# Altium schematic sheet _accel_mag.SchDoc
size Tabloid
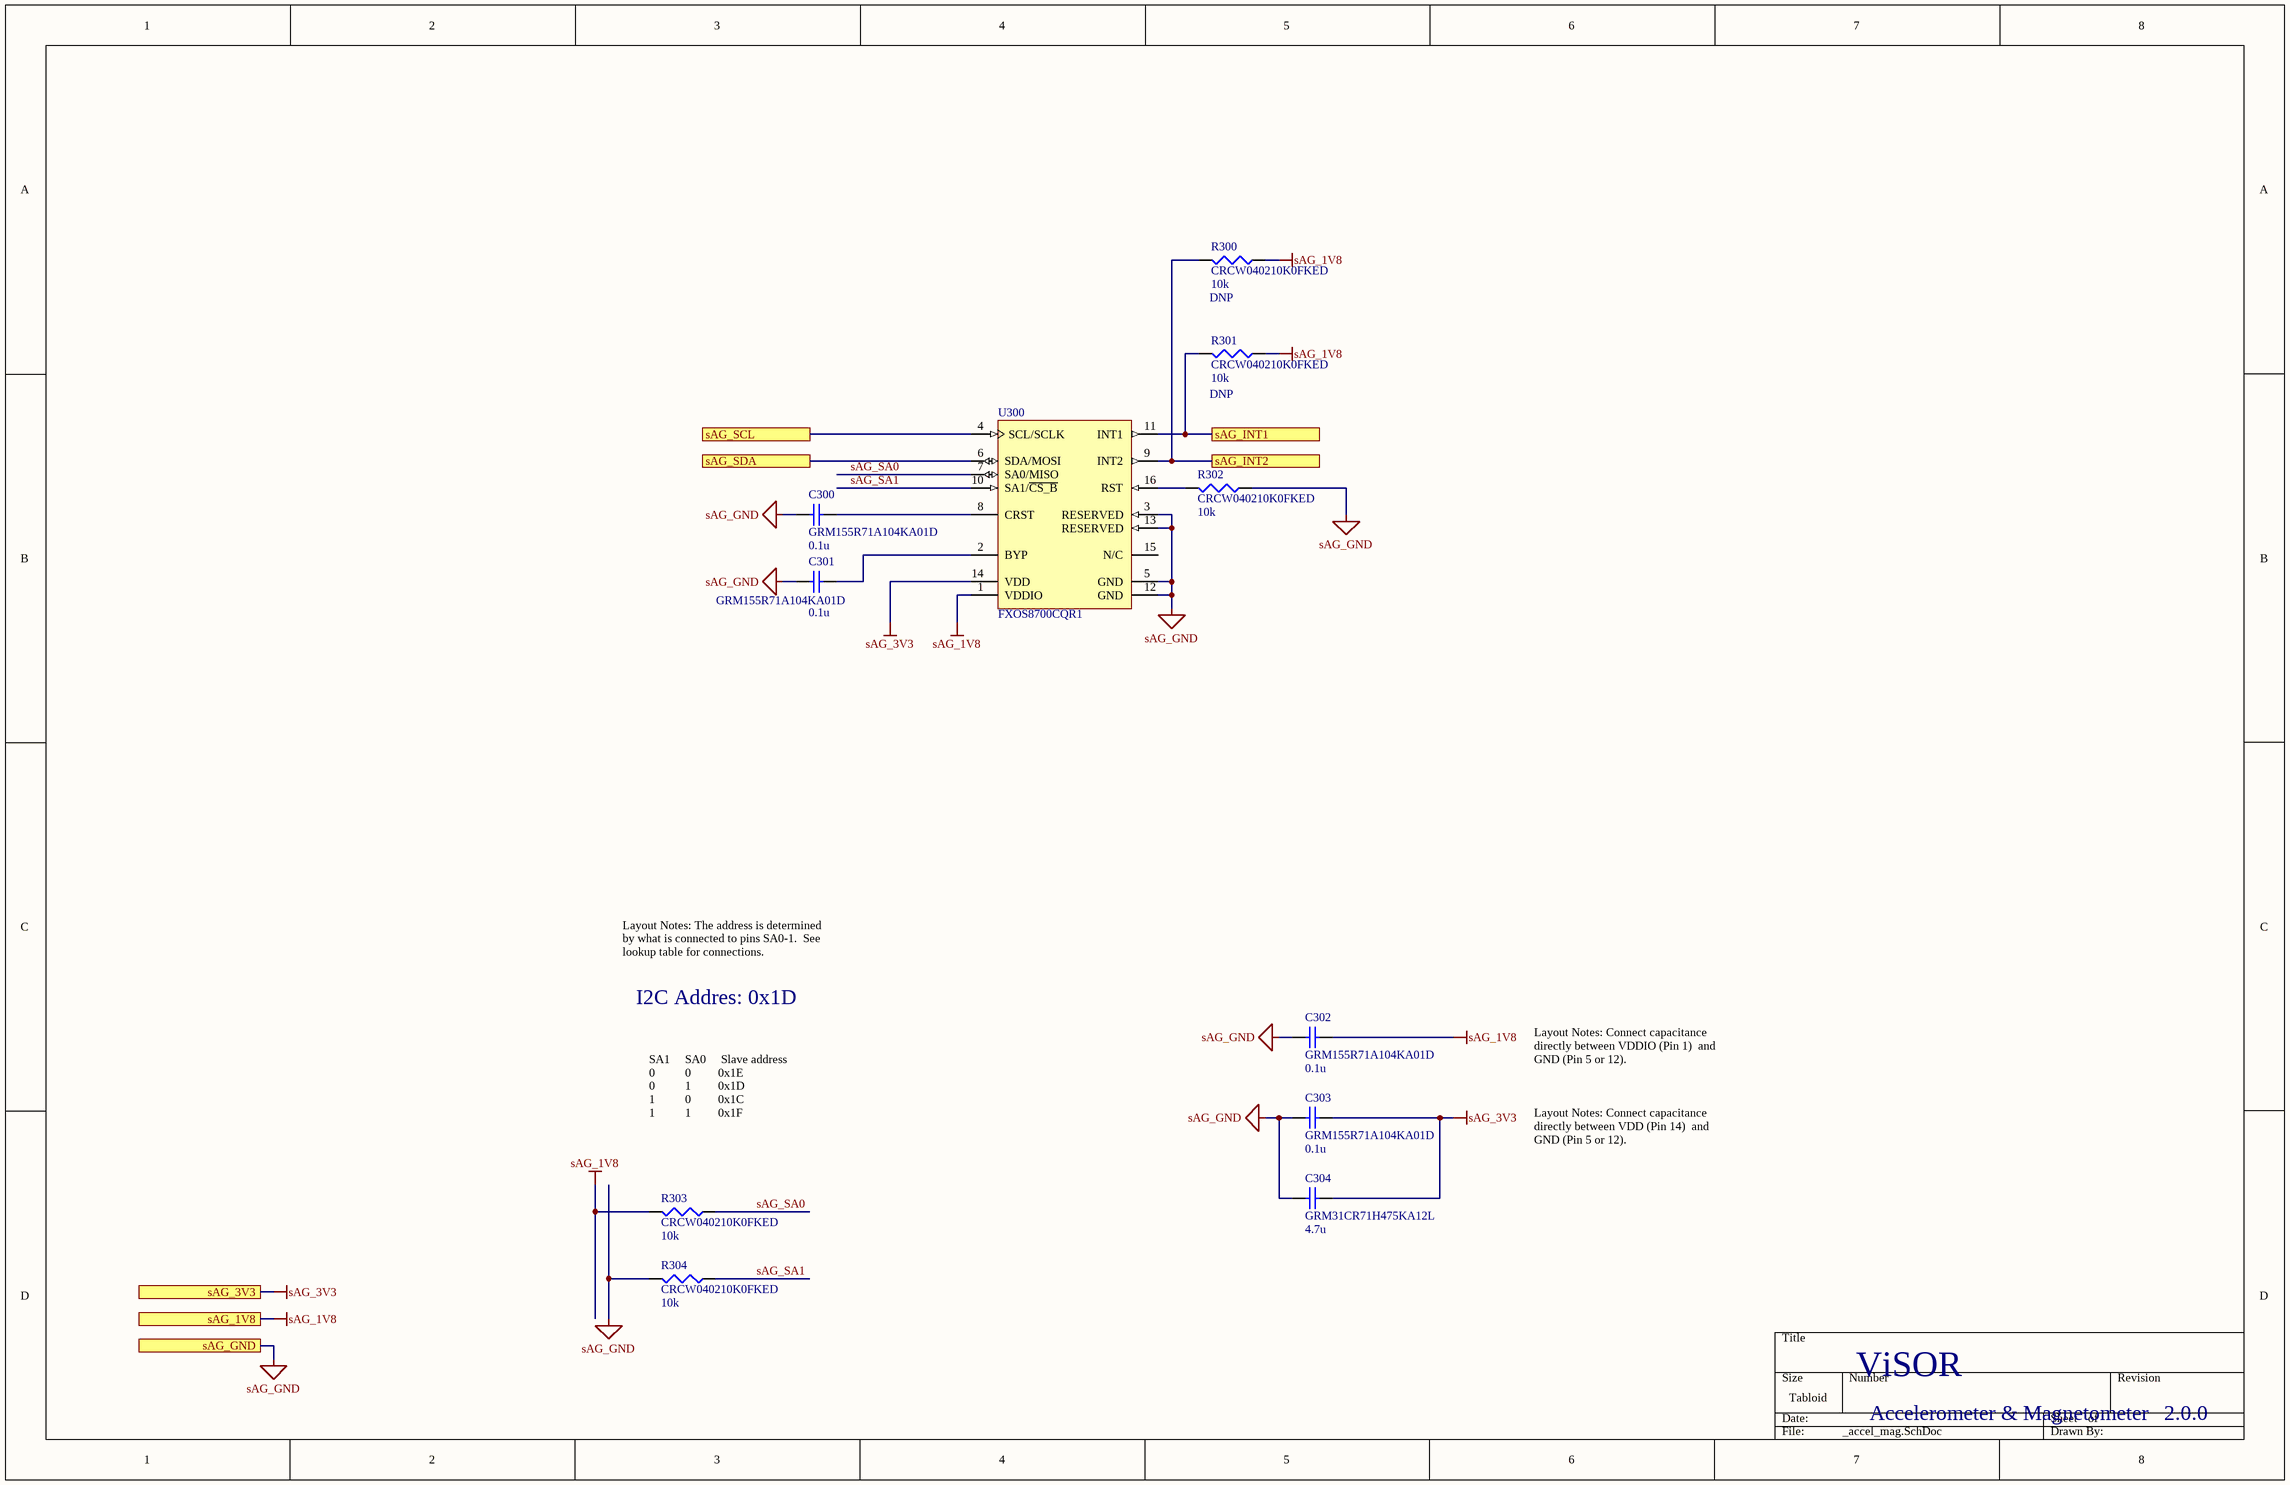
[diagram p0: _accel_mag.SchDoc]

## Parts
C300  GRM155R71A104KA01D  value 0.1u  [0402]
C301  GRM155R71A104KA01D  value 0.1u  [0402]
C302  GRM155R71A104KA01D  value 0.1u  [0402]
C303  GRM155R71A104KA01D  value 0.1u  [0402]
C304  GRM31CR71H475KA12L  value 4.7u  [1206]
R300  CRCW040210K0FKED  value 10k  [0402]
R301  CRCW040210K0FKED  value 10k  [0402]
R302  CRCW040210K0FKED  value 10k  [0402]
R303  CRCW040210K0FKED  value 10k  [0402]
R304  CRCW040210K0FKED  value 10k  [0402]
U300  FXOS8700CQR1  [FREE-QFN-16-3000X3000DE_V]

## Ports
sAG_1V8, sAG_3V3, sAG_GND, sAG_INT1, sAG_INT2, sAG_SCL, sAG_SDA

## Nets
sAG_1V8: C302.2 R300.1 R301.1 R303.2 U300.1(VDDIO) ; port sAG_1V8
sAG_3V3: C303.2 C304.2 U300.14(VDD) ; port sAG_3V3
sAG_GND: C300.2 C301.2 C302.1 C303.1 C304.1 R302.1 R304.2 U300.3(RESERVED) U300.5(GND) U300.12(GND) U300.13(RESERVED) ; port sAG_GND
sAG_INT1: R301.2 U300.11(INT1) ; port sAG_INT1
sAG_INT2: R300.2 U300.9(INT2) ; port sAG_INT2
sAG_SA0: R303.1 U300.7(SA0/MISO)
sAG_SA1: R304.1 U300.10(SA1/~{CS_B})
sAG_SCL: U300.4(SCL/SCLK) ; port sAG_SCL
sAG_SDA: U300.6(SDA/MOSI) ; port sAG_SDA
NetC300_1: C300.1 U300.8(CRST)
NetC301_1: C301.1 U300.2(BYP)
NetR302_2: R302.2 U300.16(RST)

Not connected (* = marked no-connect by the designer): U300 15(N/C)

## Notes on the sheet
- Layout Notes: The address is determined by what is connected to pins SA0-1.  See lookup table for connections.
- I2C Addres: 0x1D
- Layout Notes: Connect capacitance directly between VDDIO (Pin 1)  and GND (Pin 5 or 12).
- SA1     SA0     Slave address
  0          0         0x1E
  0          1         0x1D
  1          0         0x1C
  1          1         0x1F
- Layout Notes: Connect capacitance directly between VDD (Pin 14)  and GND (Pin 5 or 12).
- ViSOR
- Accelerometer & Magnetometer
- 2.0.0
- (in symbol CRCW0402xxxxFKED) DNP

## Library data of the parts
C300-C303 = GRM155R71AxxxKdddd: -55-125C, 1005, 10V, X7R, ±10%
C304 = GRM31CR71HxxxKdddd: -55-125C, 3216, 50V, X7R, ±10%
R300-R304 = CRCW0402xxxxFKED: 0.125W, -55-155C, 1005, 50V, ±1%
U300 = CMP-2000-05129-1: 6-Axis Xtrinsic Sensor with Integrated Linear Accelerometer and Magnetometer, 1.95 to 3.6 V, -40 to 85 degC, 16-Pin QFN, RoHS, Tape and Reel; Manufacturer: Freescale; Supply Voltage - Min: 1.95V; Operating Supply Voltage: 1.95Vto3.6V; Unit Weight: 0.000808oz; Supply Voltage - Max: 3.6V; Brand: FreescaleSemiconductor; Sensing Axis: X,Y,Z; Output Type: Digital; Package / Case: QFN-16; Datasheet Version: Rev. 1, 06/2012; Factory Pack Quantity: 1000; Mounting Style: SMD/SMT; Datasheet URL: https://datasheet.ciiva.com/12175/fxos8700cq-60595-12175213.pdf; Type: 6AxisSensor; Maximum Operating Temperature: +85C; Manufacturer URL: http://www.nxp.com/; Package Description: 16-Pin Quad Flat No-lead Package, Body 3 x 3 mm, Pitch 0.5 mm; RoHS: Details; Package Reference: QFN-16; Tradename: Xtrinsic; Packaging: Reel; Minimum Operating Temperature: -40C; Product Category: BoardMountAccelerationSensors